# EAGLE design GammaDetector (EAGLE 5.11)
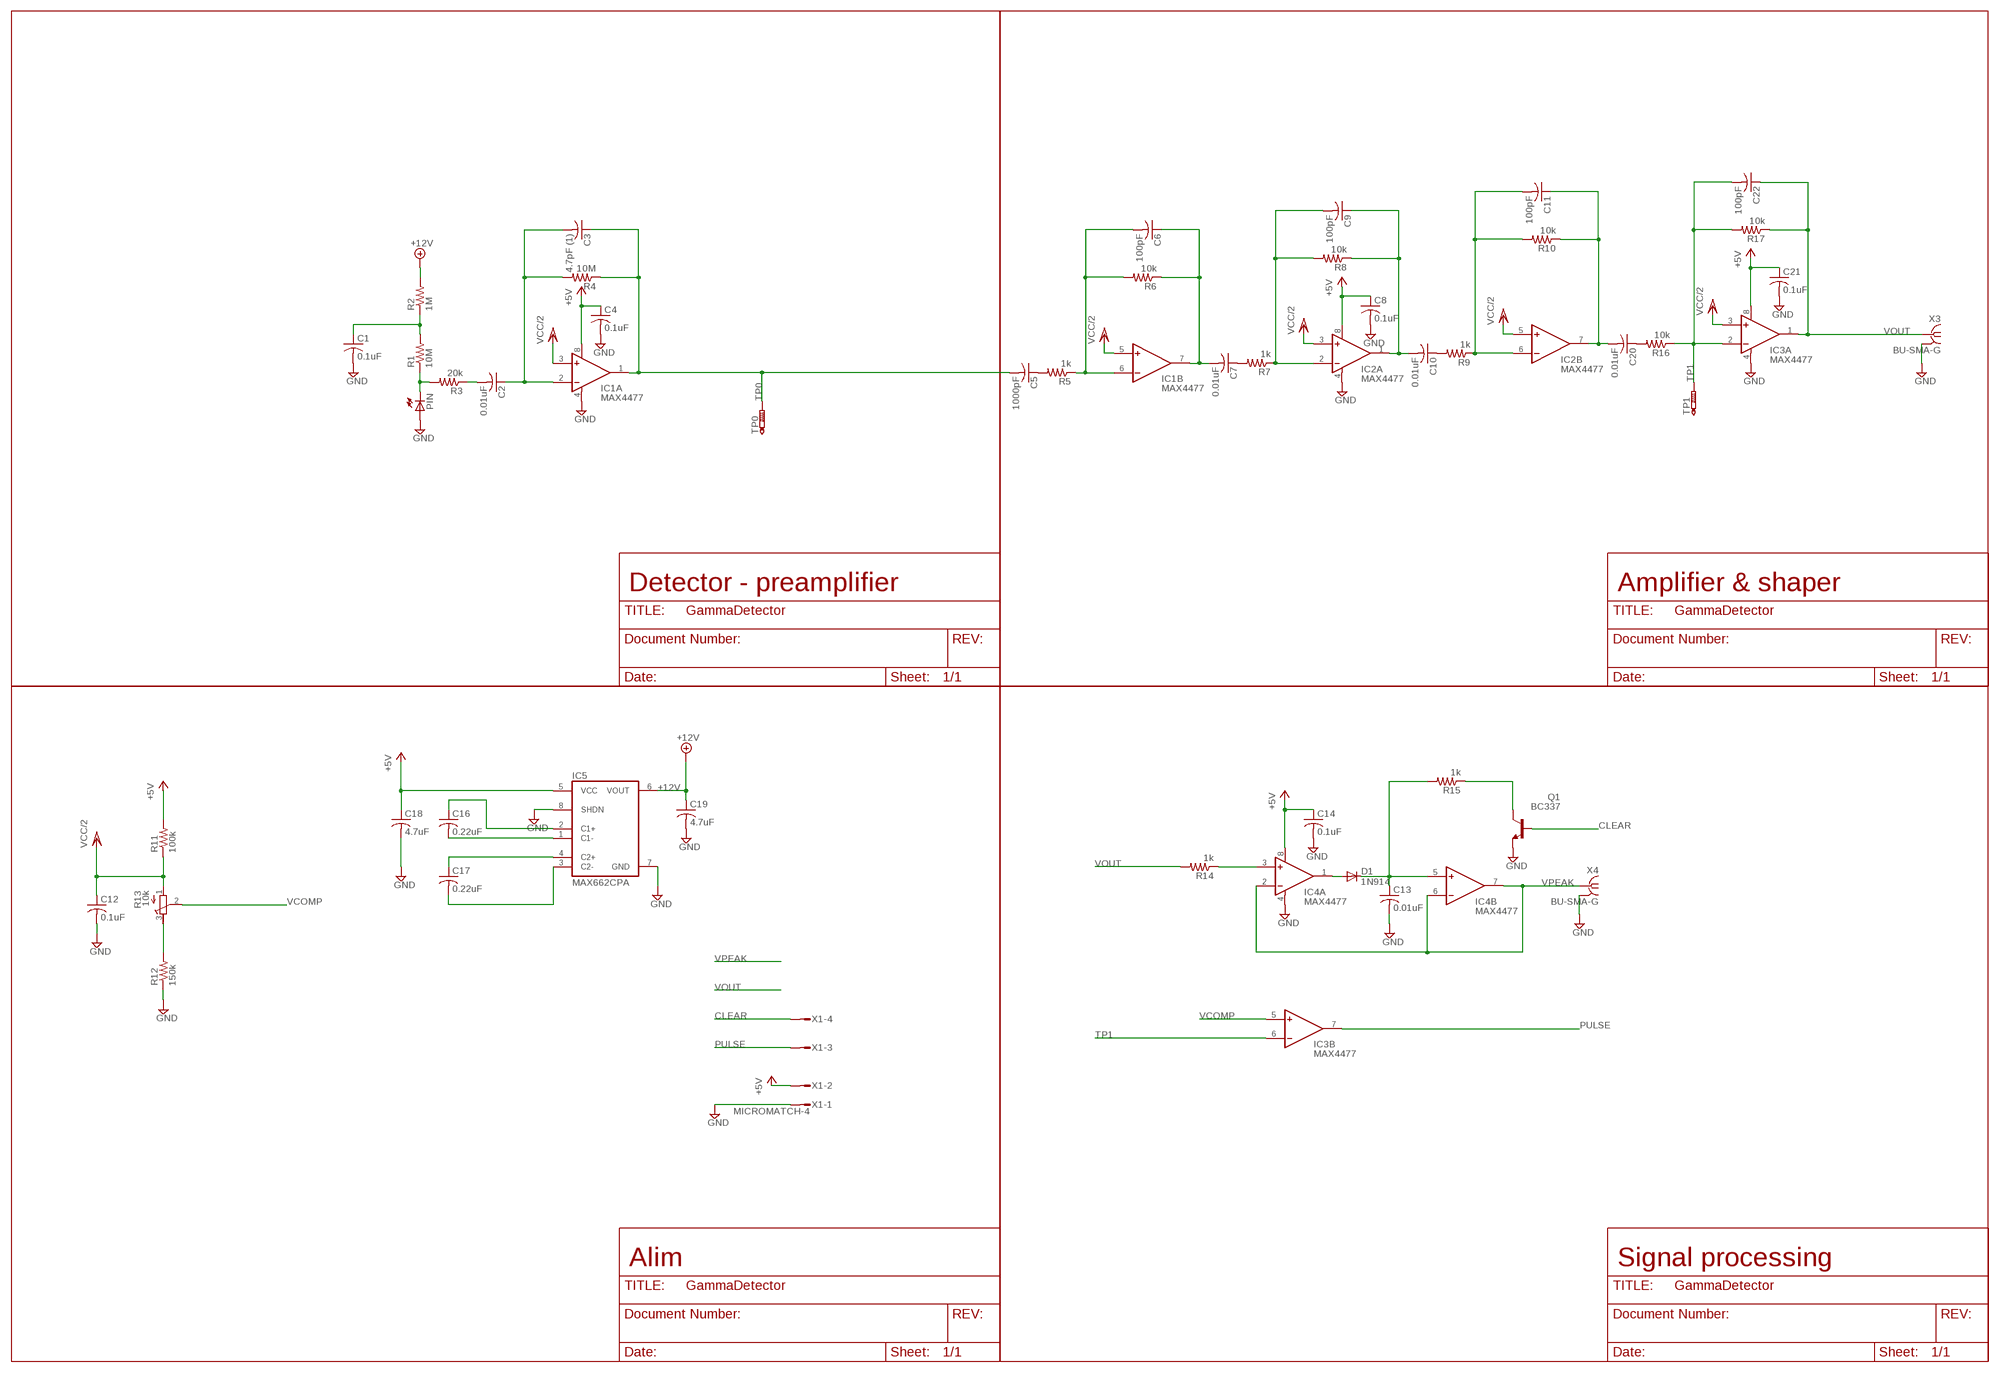
[diagram p0: schematic, sheet 1]

## Parts
C1  0.1uF  C-USC0805  [C0805]
C2  0.01uF  C-USC0805  [C0805]
C3  4.7pF (1)  C-USC0805  [C0805]
C4  0.1uF  C-USC0805  [C0805]
C5  1000pF  C-USC0805  [C0805]
C6  100pF  C-USC0805  [C0805]
C7  0.01uF  C-USC0805  [C0805]
C8  0.1uF  C-USC0805  [C0805]
C9  100pF  C-USC0805  [C0805]
C10  0.01uF  C-USC0805  [C0805]
C11  100pF  C-USC0805  [C0805]
C12  0.1uF  C-USC0805  [C0805]
C13  0.01uF  C-USC0805  [C0805]
C14  0.1uF  C-USC0805  [C0805]
C16  0.22uF  C-USC0805K  [C0805K]
C17  0.22uF  C-USC0805K  [C0805K]
C18  4.7uF  C-USC1210K  [C1210K]
C19  4.7uF  C-USC1210K  [C1210K]
C20  0.01uF  C-USC0805  [C0805]
C21  0.1uF  C-USC0805  [C0805]
C22  100pF  C-USC0805  [C0805]
D1  1N914  1N4148DO35-10  [DO35-10]
IC1  MAX4477  ICL7621SA  [SO08]
IC2  MAX4477  ICL7621SA  [SO08]
IC3  MAX4477  ICL7621SA  [SO08]
IC4  MAX4477  ICL7621SA  [SO08]
IC5  MAX662CPA  [DIL08]
PIN  LED5MM  [LED5MM]
Q1  BC337  [TO92]
R1  10M  R-US_R0805  [R0805]
R2  1M  R-US_R0805  [R0805]
R3  20k  R-US_R0805  [R0805]
R4  10M  R-US_R0805  [R0805]
R5  1k  R-US_R0805  [R0805]
R6  10k  R-US_R0805  [R0805]
R7  1k  R-US_R0805  [R0805]
R8  10k  R-US_R0805  [R0805]
R9  1k  R-US_R0805  [R0805]
R10  10k  R-US_R0805  [R0805]
R11  100k  R-US_R0805  [R0805]
R12  150k  R-US_R0805  [R0805]
R13  10k  R-TRIMM3224G  [RTRIM3224G]
R14  1k  R-US_R0805  [R0805]
R15  1k  R-US_R0805  [R0805]
R16  10k  R-US_R0805  [R0805]
R17  10k  R-US_R0805  [R0805]
TP0  PTR1PAD1-13  [P1-13]
TP1  PTR1PAD1-13  [P1-13]
X1  MICROMATCH-4  [MICROMATCH-4]
X3  BU-SMA-G  [BU-SMA-G]
X4  BU-SMA-G  [BU-SMA-G]

## Nets
!PEAK: C13.1 D1.C IC4.5(B:+IN) R15.2
+5V: C4.1 C8.1 C14.1 C18.1 C21.1 IC1.8(A:V+) IC2.8(A:V+) IC3.8(A:V+) IC4.8(A:V+) IC5.5(VCC) R11.2 X1.2
+12V: C19.1 IC5.6(VOUT) R2.2
CLEAR: Q1.2(B) X1.4
GND: C1.2 C4.2 C8.2 C12.2 C13.2 C14.2 C18.2 C19.2 C21.2 IC1.4(A:V-) IC2.4(A:V-) IC3.4(A:V-) IC4.4(A:V-) IC5.7(GND) IC5.8(SHDN) PIN.A Q1.1(E) R12.1 X1.1 X3.2(GND) X4.2(GND)
N$1: C1.1 R1.2 R2.1
N$2: PIN.K(C) R1.1 R3.2
N$3: C5.1 R5.2
N$4: C2.1 C3.2 IC1.2(A:-IN) R4.2
N$5: C6.2 IC1.6(B:-IN) R5.1 R6.2
N$6: C6.1 C7.2 IC1.7(B:OUT) R6.1
N$7: C2.2 R3.1
N$8: C7.1 R7.2
N$9: C9.2 IC2.2(A:-IN) R7.1 R8.2
N$10: C9.1 C10.2 IC2.1(A:OUT) R8.1
N$11: C10.1 R9.2
N$12: C11.2 IC2.6(B:-IN) R9.1 R10.2
N$13: C17.1 IC5.4(C2+)
N$14: R12.2 R13.3(A)
N$15: C17.2 IC5.3(C2-)
N$16: C16.2 IC5.1(C1-)
N$17: IC4.3(A:+IN) R14.1
N$18: C16.1 IC5.2(C1+)
N$19: D1.A IC4.1(A:OUT)
N$20: Q1.3(C) R15.1
N$21: C11.1 C20.2 IC2.7(B:OUT) R10.1
N$23: C20.1 R16.2
PULSE: IC3.7(B:OUT) X1.3
TP0: C3.1 C5.2 IC1.1(A:OUT) R4.1 TP0.TP
TP1: C22.2 IC3.2(A:-IN) IC3.6(B:-IN) R16.1 R17.2 TP1.TP
VCC/2: C12.1 IC1.3(A:+IN) IC1.5(B:+IN) IC2.3(A:+IN) IC2.5(B:+IN) IC3.3(A:+IN) R11.1 R13.1(E)
VCOMP: IC3.5(B:+IN) R13.2(S)
VOUT: C22.1 IC3.1(A:OUT) R14.2 R17.1 X3.1
VPEAK: IC4.2(A:-IN) IC4.6(B:-IN) IC4.7(B:OUT) X4.1

## Notes on the sheet
- Detector - preamplifier | Amplifier & shaper
- Alim | Signal processing

## Power pins joined to a net without a drawn wire
GND: X3.3(GND) X3.4(GND) X3.5(GND) X4.3(GND) X4.4(GND) X4.5(GND)

## Library data of the parts
C1-C14 C16-C22 = rcl:C-US: CAPACITOR, American symbol
D1 = diode:1N4148: DIODE high speed (Philips)
IC1-IC4 = maxim:ICL7621: Dual Operational Amplifiers Source: http://datasheets.maxim-ic.com/en/ds/ICL7612-ICL764X.pdf; OC_FARNELL: unknown; OC_NEWARK: unknown
IC5 = maxim:MAX662CPA: SUPPLY CHARGE PUMP; OC_FARNELL: unknown; OC_NEWARK: unknown
PIN = led:LED: LED OSRAM: - CHIPLED LG R971, LG N971, LY N971, LG Q971, LY Q971, LO R971, LY R971 LH N974, LH R974 LS Q976, LO Q976, LY Q976 LO Q996 - Hyper CHIPLED LW Q18S LB Q993, LB Q99A, LB R99A - SideLED LS A670, LO A670, LY A670, LG A670, LP A670 LB A673, LV A673, LT A673, LW A673 LH A674 LY A675 LS A676, LA A676, LO A676, LY A676, LW A676 LS A679, LY A679, LG A679 - Hyper Micro SIDELED® LS Y876, LA Y876, LO Y876, LY Y876 LT Y87S - SmartLED LW L88C, LW L88S LB L89C, LB L89S, LG L890 LS L89K, LO L89K, LY L89K LS L896, LA L896, LO L896, LY L896 - TOPLED LS T670, LO T670, LY T670, LG T670, LP T670 LSG T670, LSP T670, LSY T670, LOP T670, LYG T670 LG T671, LOG T671, LSG T671 LB T673, LV T673, LT T673, LW T673 LH T674 LS T676, LA T676, LO T676, LY T676, LB T676, LH T676, LSB T676, LW T676 LB T67C, LV T67C, LT T67C, LS T67K, LO T67K, LY T67K, LW E67C LS E67B, LA E67B, LO E67B, LY E67B, LB E67C, LV E67C, LT E67C LW T67C LS T679, LY T679, LG T679 LS T770, LO T770, LY T770, LG T770, LP T770 LB T773, LV T773, LT T773, LW T773 LH T774 LS E675, LA E675, LY E675, LS T675 LS T776, LA T776, LO T776, LY T776, LB T776 LHGB T686 LT T68C, LB T68C - Hyper Mini TOPLED® LB M676 - Mini TOPLED Santana® LG M470 LS M47K, LO M47K, LY M47K Source: http://www.osram.convergy.de LUXEON: - LUMILED® LXK2-PW12-R00, LXK2-PW12-S00, LXK2-PW14-U00, LXK2-PW14-V00 LXK2-PM12-R00, LXK2-PM12-S00, LXK2-PM14-U00 LXK2-PE12-Q00, LXK2-PE12-R00, LXK2-PE12-S00, LXK2-PE14-T00, LXK2-PE14-U00 LXK2-PB12-K00, LXK2-PB12-L00, LXK2-PB12-M00, LXK2-PB14-N00, LXK2-PB14-P00, LXK2-PB14-Q00 LXK2-PR12-L00, LXK2-PR12-M00, LXK2-PR14-Q00, LXK2-PR14-R00 LXK2-PD12-Q00, LXK2-PD12-R00, LXK2-PD12-S00 LXK2-PH12-R00, LXK2-PH12-S00 LXK2-PL12-P00, LXK2-PL12-Q00, LXK2-PL12-R00 Source: www.luxeon.com KINGBRIGHT: KA-3528ASYC Source: www.kingbright.com
Q1 = transistor-npn:BC337*: NPN Transistor
R1-R12 R14-R17 = rcl:R-US_: RESISTOR, American symbol
R13 = rcl:R-TRIMM: Trimm resistor
TP0 TP1 = testpad:PTR1: TEST PIN
X1 = con-amp-micromatch:MICROMATCH-4: MicroMaTch 4 7-215464-4 / 0-215464-4 Drawing Number C-215464 DDEController.pdf; MPN: 7-215464-4; OC_FARNELL: 3784629; OC_NEWARK: 19R8124
X3 X4 = con-coax:BU-SMA-G: FEMALE SMA CONNECTOR Radiall distributor RS 193-9117; OC_FARNELL: unknown; OC_NEWARK: unknown

## Board
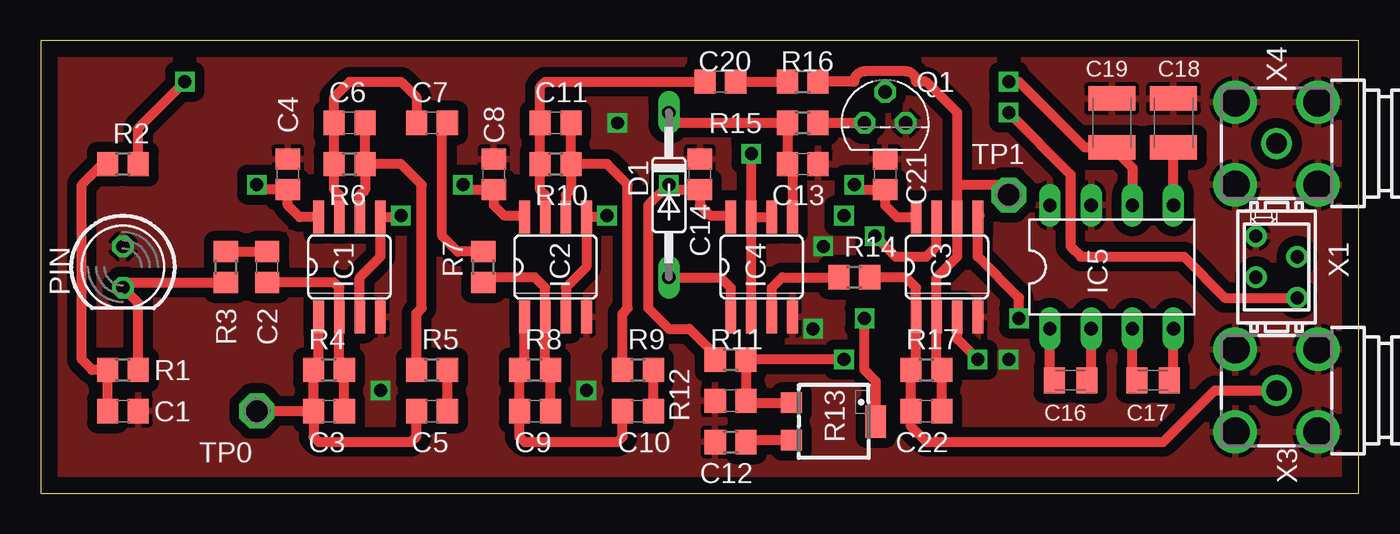
[diagram p1: board, top side]
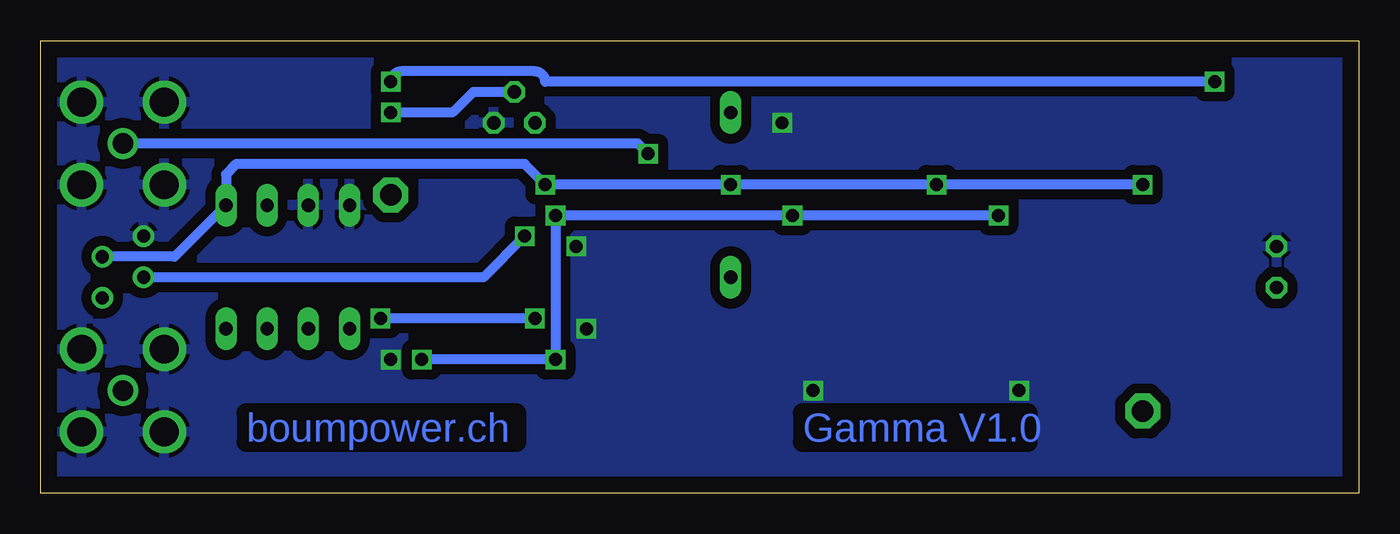
[diagram p2: board, bottom side, seen from below]

Size 81.28 x 27.94 mm. Coordinates in mm from the lower left corner, seen from the top.
Outline: 0,0 81.28,0 81.28,27.94 0,27.94 0,0
Copper layers (1*16): Top 0.035mm / dielectric 1.5mm / Bottom 0.035mm
Design rules "8mils": minimum track width 8mil, minimum drill 0.6mm, track to track 8mil, track to pad 8mil, pad to pad 8mil, via to via 8mil, smd to smd 8mil, copper to edge 40mil, drill to drill 10mil, minimum pad ring 10mil, minimum via ring 8mil, stop-mask expansion 0mil, vias tented up to drill 0mil, thermal gap 10mil

### Footprints (pad centres in the part's own frame; a part is rotated, then mirrored left to right if it is on the bottom)
C0805 = smd 1.3 x 1.5: 1 -0.95,0; 2 0.95,0
C0805K = smd 1.3 x 1.6: 1 -1,0; 2 1,0
C1210K = smd 1.5 x 2.9: 1 -1.5,0; 2 1.5,0
DO35-10 = drill 0.813 long: A 5.08,0; C -5.08,0
SO08 = smd 0.66 x 2.032: 1 -1.905,-3.073; 2 -0.635,-3.073; 3 0.635,-3.073; 4 1.905,-3.073; 5 1.905,3.073; 6 0.635,3.073; 7 -0.635,3.073; 8 -1.905,3.073
DIL08 = drill 0.813 long: 1 -3.81,-3.81; 2 -1.27,-3.81; 3 1.27,-3.81; 4 3.81,-3.81; 5 3.81,3.81; 6 1.27,3.81; 7 -1.27,3.81; 8 -3.81,3.81
LED5MM = drill 0.813 octagon: A -1.27,0; K 1.27,0
TO92 = drill 0.813 octagon: 1 1.27,0; 2 0,1.905; 3 -1.27,0
R0805 = smd 1.3 x 1.5: 1 -0.95,0; 2 0.95,0
RTRIM3224G = smd 1.27 x 1.27: 1 -1.15,-2.6; 3 1.15,-2.6 | smd 2 x 1.27: 2 0,2.6
P1-13 = drill 1.321 pad 2.159 octagon: TP 0,0
MICROMATCH-4 = drill 0.813 round: 1 1.905,1.27; 2 0.635,-1.27; 3 -0.635,1.27; 4 -1.905,-1.27
BU-SMA-G = drill 1.27 round: 1 0,0 | drill 1.778 round: 2 -2.55,2.55; 3 2.55,2.55; 4 2.55,-2.55; 5 -2.55,-2.55

### Placement (x,y rotation side)
C1  5.08,5.08 0 top
C2  13.97,13.97 90 top
C3  17.78,5.08 0 top
C4  15.24,19.68 90 top
C5  24.13,5.08 180 top
C6  19.05,22.86 0 top
C7  24.13,22.86 180 top
C8  27.94,19.68 90 top
C9  30.48,5.08 0 top
C10  36.83,5.08 180 top
C11  31.75,22.86 0 top
C12  42.55,5.71 180 top
C13  46.99,20.32 0 top
C14  40.64,19.68 90 top
C16  63.5,6.99 180 top
C17  68.58,6.99 180 top
C18  69.85,22.86 90 top
C19  66.04,22.86 90 top
C20  41.91,25.4 180 top
C21  52.07,19.68 90 top
C22  54.61,5.08 0 top
D1  38.73,18.41 270 top
IC1  19.05,13.97 0 top
IC2  31.75,13.97 0 top
IC3  55.88,13.97 0 top
IC4  44.45,13.97 0 top
IC5  66.04,13.97 0 top
PIN  5.08,13.97 270 top
Q1  52.07,22.86 0 top
R1  5.08,7.62 180 top
R2  5.08,20.32 0 top
R3  11.43,13.97 270 top
R4  17.78,7.62 0 top
R5  24.13,7.62 0 top
R6  19.05,20.32 0 top
R7  27.3,13.97 90 top
R8  30.48,7.62 0 top
R9  36.83,7.62 0 top
R10  31.75,20.32 0 top
R11  42.55,8.26 180 top
R12  42.55,3.17 0 top
R13  48.9,4.45 270 top
R14  50.16,13.34 0 top
R15  46.99,22.86 180 top
R16  46.99,25.4 180 top
R17  54.61,7.62 0 top
TP0  13.34,5.09 0 top
TP1  59.69,18.41 0 top
X1  76.2,13.97 90 top
X3  76.2,6.35 0 top
X4  76.2,21.59 0 top

### Tracks (layer width: path | path; a pad name or v marks a point on that pad's centre or on a via)
!PEAK
  Top 0.61: C13.1 46.35,20 | R15.2 | IC4.5 46.35,20 C13.1 | R15.2 C13.1 | R15.2 39.37,22.86 D1.C
+5V  (via drill 0.8)
  Top 0.61: IC1.8 15.98,17.04 15.24,17.78 C4.1 13.65,18.73 v13.34,19.05 | IC2.8 29.74,17.14 28.57,17.14 27.94,17.78 C8.1 26.35,18.73 v26.04,19.05 | IC4.8 42.44,17.14 41.27,17.14 40.64,17.78 C14.1 39.05,18.73 v38.73,19.05 37.47,17.78 37.47,11.43 38.73,10.16 40.01,10.16 41.59,8.57 R11.2 | IC3.8 52.81,17.04 52.07,17.78 C21.1 50.48,18.73 v50.16,19.05 | IC5.5 C18.1
  Bottom 0.61: v13.34,19.05 v26.04,19.05 v38.73,19.05 v50.16,19.05 51.44,20.32 69.22,20.32 69.85,19.68 IC5.5 73.03,14.61 X1.2
+12V  (via drill 0.8)
  Top 0.61: R2.2 6.03,22.54 v8.89,25.4 | IC5.6 67.31,20.09 C19.1 64.36,21.36 60.33,25.4 v59.69,25.4
  Bottom 0.61: v8.89,25.4 50.16,25.4 arc-90 50.8,26.04 59.05,26.04 arc-90 v59.69,25.4
CLEAR  (via drill 0.8)
  Top 0.61: X1.4 73.03,12.06 70.48,14.61 64.14,14.61 63.5,15.24 63.5,19.68 v59.69,23.5
  Bottom 0.61: v59.69,23.5 55.88,23.5 54.61,24.77 Q1.2
GND  (via drill 0.8)
  other vias: 20.95,6.35 33.66,6.35 35.56,22.86 47.62,10.16 59.69,8.26 48.26,15.24
  pour Top (isolate 0.61): 0,0 81.28,0 81.28,27.94 0,27.94
  pour Bottom (isolate 0.61): 0,0 81.28,0 81.28,27.94 0,27.94
N$1
  Top 0.61: R2.1 3.81,20.32 2.54,19.05 2.54,8.26 3.17,7.62 R1.2 C1.1
N$2
  Top 0.61: R1.1 6.03,11.75 PIN.K 5.4,13.02 R3.2
N$3
  Top 0.61: C5.1 R5.2
N$4
  Top 0.61: C3.2 R4.2 18.41,7.62 IC1.2 18.41,12.7 18.09,13.02 C2.1
N$5
  Top 0.61: R6.2 C6.2 | R6.2 20,18.73 19.68,18.41 IC1.6 | R5.1 23.18,11.12 23.5,11.43 23.5,19.05 22.23,20.32 R6.2
N$6
  Top 0.61: IC1.7 18.41,18.41 18.1,18.73 R6.1 C6.1 18.1,24.45 19.05,25.4 22.23,25.4 23.18,24.45 C7.2
N$7
  Top 0.61: R3.1 C2.2
N$8
  Top 0.61: R7.2 25.72,14.92 24.77,15.88 24.77,22.55 C7.1
N$9
  Top 0.61: C9.2 R8.2 31.11,7.93 IC2.2 31.11,12.7 30.48,13.34 27.62,13.34 R7.1
N$10
  Top 0.61: IC2.1 29.84,7.93 R8.1 C9.1 29.53,3.49 29.84,3.17 35.56,3.17 35.88,3.5 C10.2
N$11
  Top 0.61: C10.1 R9.2
N$12
  Top 0.61: R10.2 32.7,18.73 32.38,18.41 IC2.6 | R10.2 34.92,20.32 36.2,19.05 36.2,11.43 35.88,11.12 R9.1 | R10.2 C11.2
N$13
  Top 0.61: IC5.4 69.85,7.25 C17.1
N$14
  Top 0.61: R13.3 43.62,3.29 R12.2
N$15
  Top 0.61: IC5.3 67.31,7.25 C17.2
N$16
  Top 0.61: IC5.1 62.23,7.25 C16.2
N$17
  Top 0.61: IC4.3 45.09,12.7 45.72,13.34 R14.1
N$18
  Top 0.61: IC5.2 64.77,7.25 C16.1
N$19
  Top 0.61: IC4.1 42.55,12.7 41.91,13.34 D1.A
N$20
  Top 0.61: R15.1 Q1.3
N$21
  Top 0.61: IC2.7 31.11,18.41 30.8,18.73 R10.1 C11.1 30.8,25.09 31.11,25.4 C20.2
N$23
  Top 0.61: C20.1 R16.2
PULSE  (via drill 0.8)
  Top 0.61: IC3.7 55.24,15.24 54.61,14.61 52.7,14.61 v51.44,15.88
  Bottom 0.61: v51.44,15.88 53.98,13.34 X1.3
TP0
  Top 0.61: IC1.1 17.14,7.62 R4.1 C3.1 | TP0.TP C3.1 | C3.1 16.83,3.49 17.14,3.17 22.86,3.17 23.18,3.5 C5.2
TP1
  Top 0.61: C22.2 R17.2 55.24,7.93 IC3.2 55.24,13.34 56.52,14.61 IC3.6 56.52,19.05 | R16.1 50.16,25.4 arc-90 50.8,26.04 53.34,26.04 arc-90 53.98,25.4 54.61,25.4 56.52,23.5 56.52,19.05 | TP1.TP 59.05,19.05 56.52,19.05
VCC/2  (via drill 0.8)
  Top 0.61: IC1.3 19.68,13.34 20.95,14.61 IC1.5 22.12,17.04 v22.23,17.14 | IC2.3 32.38,12.7 33.66,13.97 IC2.5 34.82,17.04 v34.92,17.14 | R13.1 43.62,5.59 C12.1 R11.1 v49.53,8.26 | IC3.3 56.52,9.53 v57.78,8.26
  Bottom 0.61: v22.23,17.14 v34.92,17.14 v49.53,17.14 v49.53,8.26 v57.78,8.26
VCOMP  (via drill 0.8)
  Top 0.61: R13.2 51.49,6.92 50.8,7.62 v50.8,10.79 | 57.89,17.14 IC3.5 57.78,14.61 60.33,12.06 v60.33,10.79
  Bottom 0.61: v50.8,10.79 v60.33,10.79
VOUT
  Top 0.61: X3.1 72.39,6.35 69.22,3.17 54.61,3.17 53.66,4.12 C22.1 R17.1 53.98,7.93 IC3.1 53.98,12.7 53.34,13.34 R14.2
VPEAK  (via drill 0.8)
  Top 0.61: IC4.2 IC4.7 | IC4.7 IC4.6 | IC4.7 v43.81,20.95
  Bottom 0.61: X4.1 44.45,21.59 v43.81,20.95

### Text on the board
Bottom: Gamma V1.0 | boumpower.ch